# EAGLE schematic Stepperdriver (EAGLE 6.1)
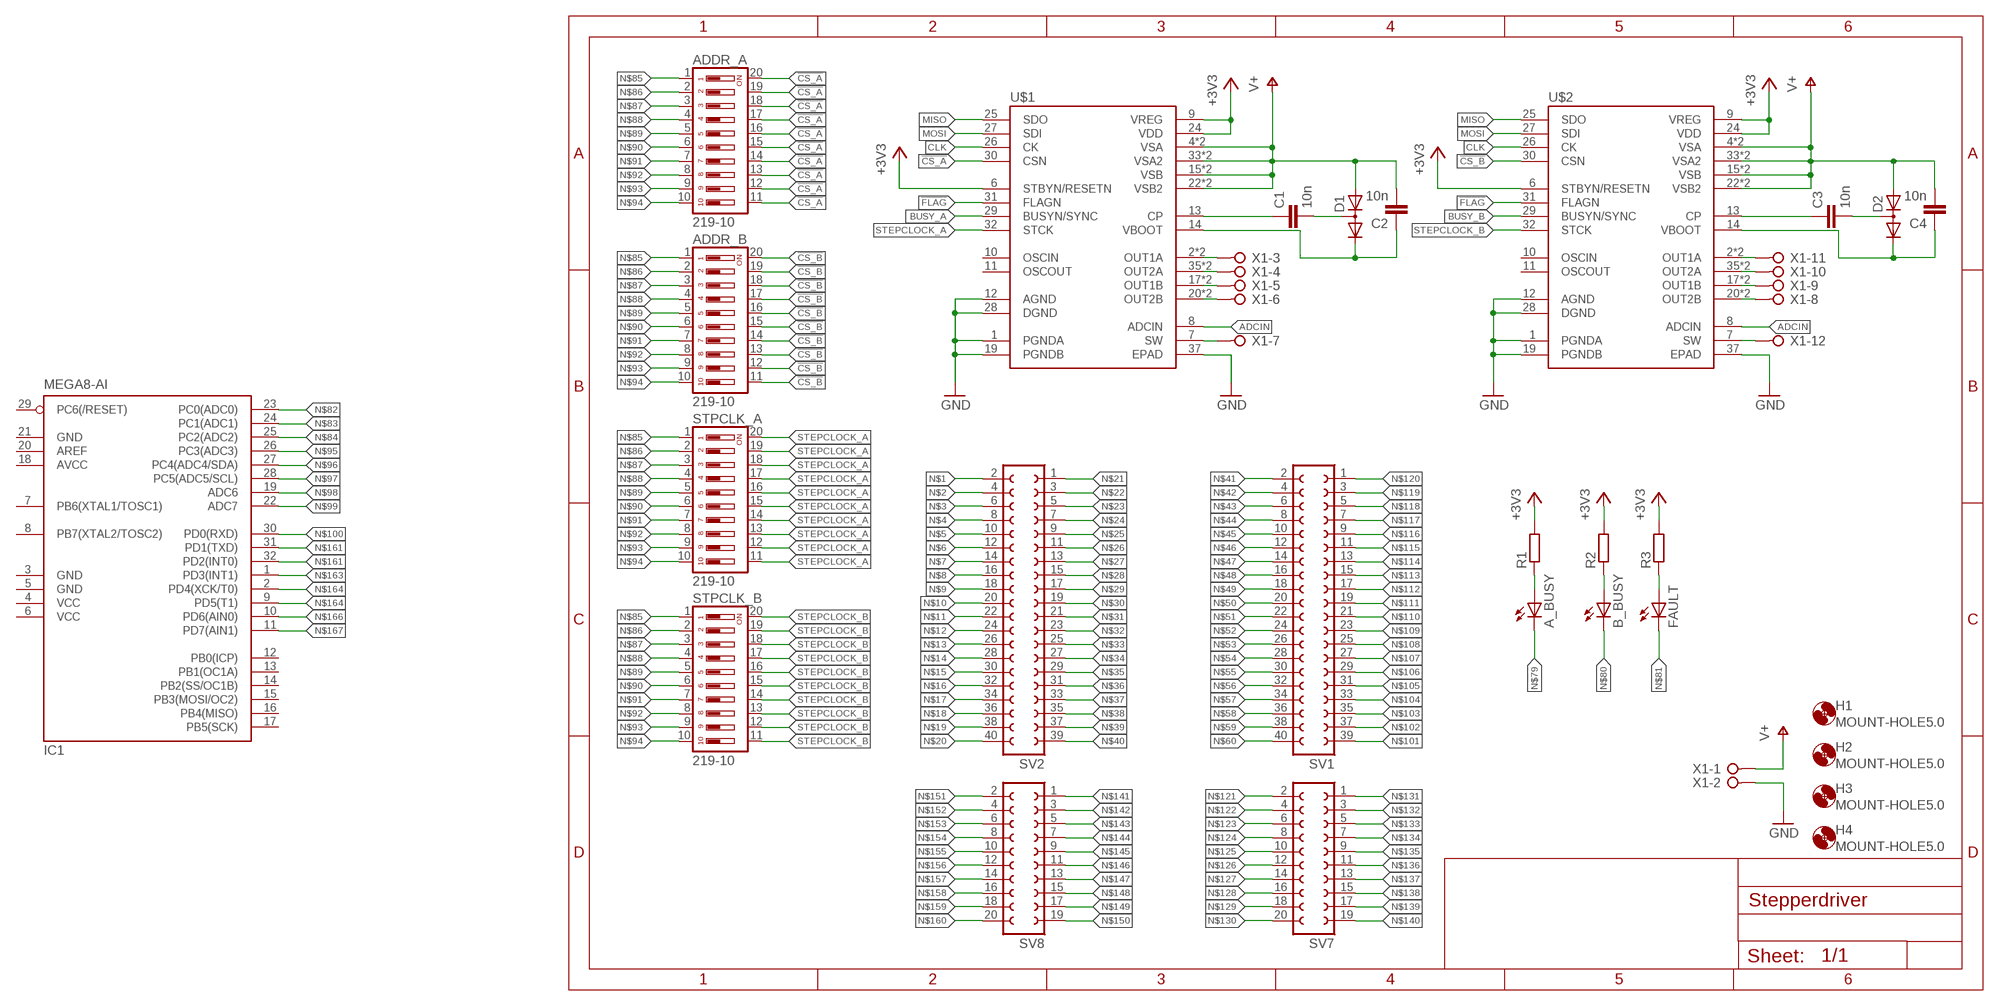
[diagram p0: schematic, sheet 1]

## Parts
A_BUSY  LEDCHIP-LED0805  [CHIP-LED0805]
ADDR_A  219-10  [CTS-219-10]
ADDR_B  219-10  [CTS-219-10]
B_BUSY  LEDCHIP-LED0805  [CHIP-LED0805]
C1  10n  C-EUC0805  [C0805]
C2  10n  C-EUC0805  [C0805]
C3  10n  C-EUC0805  [C0805]
C4  10n  C-EUC0805  [C0805]
D1  DIODE_2CACA-SOT23  [SOT23]
D2  DIODE_2CACA-SOT23  [SOT23]
FAULT  LEDCHIP-LED0805  [CHIP-LED0805]
H1  MOUNT-HOLE5.0  [5,0]
H2  MOUNT-HOLE5.0  [5,0]
H3  MOUNT-HOLE5.0  [5,0]
H4  MOUNT-HOLE5.0  [5,0]
IC1  MEGA8-AI  [TQFP32-08]
R1  R-EU_R0805  [R0805]
R2  R-EU_R0805  [R0805]
R3  R-EU_R0805  [R0805]
STPCLK_A  219-10  [CTS-219-10]
STPCLK_B  219-10  [CTS-219-10]
SV1  FE20-2  [FE20-2]
SV2  FE20-2  [FE20-2]
SV7  FE10-2  [FE10-2]
SV8  FE10-2  [FE10-2]
U$1  L6470HPOWERSO36  [SOP65P1400X360-37N]
U$2  L6470HPOWERSO36  [SOP65P1400X360-37N]
X1  W237-12P  [W237-12P]

## Nets
!CS_A: ADDR_A.11 ADDR_A.12 ADDR_A.13 ADDR_A.14 ADDR_A.15 ADDR_A.16 ADDR_A.17 ADDR_A.18 ADDR_A.19 ADDR_A.20 U$1.30(CSN)
!CS_B: ADDR_B.11 ADDR_B.12 ADDR_B.13 ADDR_B.14 ADDR_B.15 ADDR_B.16 ADDR_B.17 ADDR_B.18 ADDR_B.19 ADDR_B.20 U$2.30(CSN)
!FLAG: U$1.31(FLAGN) U$2.31(FLAGN)
+3V3: R1.2 R2.2 R3.2 U$1.6(STBYN/RESETN) U$1.9(VREG) U$1.24(VDD) U$2.6(STBYN/RESETN) U$2.9(VREG) U$2.24(VDD)
ADCIN: U$1.8(ADCIN) U$2.8(ADCIN)
BUSY_A: U$1.29(BUSYN/SYNC)
BUSY_B: U$2.29(BUSYN/SYNC)
CLK: U$1.26(CK) U$2.26(CK)
GND: U$1.1(PGNDA) U$1.12(AGND) U$1.19(PGNDB) U$1.28(DGND) U$1.37(EPAD) U$2.1(PGNDA) U$2.12(AGND) U$2.19(PGNDB) U$2.28(DGND) U$2.37(EPAD) X1.2
MISO: U$1.25(SDO) U$2.25(SDO)
MOSI: U$1.27(SDI) U$2.27(SDI)
N$1: SV2.2
N$2: SV2.4
N$3: SV2.6
N$4: SV2.8
N$5: SV2.10
N$6: SV2.12
N$7: SV2.14
N$8: SV2.16
N$9: SV2.18
N$10: SV2.20
N$11: SV2.22
N$12: SV2.24
N$13: SV2.26
N$14: SV2.28
N$15: SV2.30
N$16: SV2.32
N$17: SV2.34
N$18: SV2.36
N$19: SV2.38
N$20: SV2.40
N$21: SV2.1
N$22: SV2.3
N$23: SV2.5
N$24: SV2.7
N$25: SV2.9
N$26: SV2.11
N$27: SV2.13
N$28: SV2.15
N$29: SV2.17
N$30: SV2.19
N$31: SV2.21
N$32: SV2.23
N$33: SV2.25
N$34: SV2.27
N$35: SV2.29
N$36: SV2.31
N$37: SV2.33
N$38: SV2.35
N$39: SV2.37
N$40: SV2.39
N$41: SV1.2
N$42: SV1.4
N$43: SV1.6
N$44: SV1.8
N$45: SV1.10
N$46: SV1.12
N$47: SV1.14
N$48: SV1.16
N$49: SV1.18
N$50: SV1.20
N$51: SV1.22
N$52: SV1.24
N$53: SV1.26
N$54: SV1.28
N$55: SV1.30
N$56: SV1.32
N$57: SV1.34
N$58: SV1.36
N$59: SV1.38
N$60: SV1.40
N$61: C3.1 U$2.13(CP)
N$62: C3.2 D2.3(AC)
N$63: C4.1 D2.2(C) U$2.14(VBOOT)
N$64: U$2.20(OUT2B) U$2.21(OUT2B) X1.8
N$65: U$2.17(OUT1B) U$2.18(OUT1B) X1.9
N$66: U$2.35(OUT2A) U$2.36(OUT2A) X1.10
N$67: A_BUSY.A R1.1
N$68: U$2.2(OUT1A) U$2.3(OUT1A) X1.11
N$69: U$1.2(OUT1A) U$1.3(OUT1A) X1.3
N$70: U$1.35(OUT2A) U$1.36(OUT2A) X1.4
N$71: C1.1 U$1.13(CP)
N$72: U$1.17(OUT1B) U$1.18(OUT1B) X1.5
N$73: U$1.20(OUT2B) U$1.21(OUT2B) X1.6
N$74: C1.2 D1.3(AC)
N$75: C2.1 D1.2(C) U$1.14(VBOOT)
N$76: U$2.7(SW) X1.12
N$77: B_BUSY.A R2.1
N$78: FAULT.A R3.1
N$79: A_BUSY.C
N$80: B_BUSY.C
N$81: FAULT.C
N$82: IC1.23(PC0(ADC0))
N$83: IC1.24(PC1(ADC1))
N$84: IC1.25(PC2(ADC2))
N$85: ADDR_A.1 ADDR_B.1 STPCLK_A.1 STPCLK_B.1
N$86: ADDR_A.2 ADDR_B.2 STPCLK_A.2 STPCLK_B.2
N$87: ADDR_A.3 ADDR_B.3 STPCLK_A.3 STPCLK_B.3
N$88: ADDR_A.4 ADDR_B.4 STPCLK_A.4 STPCLK_B.4
N$89: ADDR_A.5 ADDR_B.5 STPCLK_A.5 STPCLK_B.5
N$90: ADDR_A.6 ADDR_B.6 STPCLK_A.6 STPCLK_B.6
N$91: ADDR_A.7 ADDR_B.7 STPCLK_A.7 STPCLK_B.7
N$92: ADDR_A.8 ADDR_B.8 STPCLK_A.8 STPCLK_B.8
N$93: ADDR_A.9 ADDR_B.9 STPCLK_A.9 STPCLK_B.9
N$94: ADDR_A.10 ADDR_B.10 STPCLK_A.10 STPCLK_B.10
N$95: IC1.26(PC3(ADC3))
N$96: IC1.27(PC4(ADC4/SDA))
N$97: IC1.28(PC5(ADC5/SCL))
N$98: IC1.19(ADC6)
N$99: IC1.22(ADC7)
N$100: IC1.30(PD0(RXD))
N$101: SV1.39
N$102: SV1.37
N$103: SV1.35
N$104: SV1.33
N$105: SV1.31
N$106: SV1.29
N$107: SV1.27
N$108: SV1.25
N$109: SV1.23
N$110: SV1.21
N$111: SV1.19
N$112: SV1.17
N$113: SV1.15
N$114: SV1.13
N$115: SV1.11
N$116: SV1.9
N$117: SV1.7
N$118: SV1.5
N$119: SV1.3
N$120: SV1.1
N$121: SV7.2
N$122: SV7.4
N$123: SV7.6
N$124: SV7.8
N$125: SV7.10
N$126: SV7.12
N$127: SV7.14
N$128: SV7.16
N$129: SV7.18
N$130: SV7.20
N$131: SV7.1
N$132: SV7.3
N$133: SV7.5
N$134: SV7.7
N$135: SV7.9
N$136: SV7.11
N$137: SV7.13
N$138: SV7.15
N$139: SV7.17
N$140: SV7.19
N$141: SV8.1
N$142: SV8.3
N$143: SV8.5
N$144: SV8.7
N$145: SV8.9
N$146: SV8.11
N$147: SV8.13
N$148: SV8.15
N$149: SV8.17
N$150: SV8.19
N$151: SV8.2
N$152: SV8.4
N$153: SV8.6
N$154: SV8.8
N$155: SV8.10
N$156: SV8.12
N$157: SV8.14
N$158: SV8.16
N$159: SV8.18
N$160: SV8.20
N$161: IC1.31(PD1(TXD))
N$162: IC1.32(PD2(INT0))
N$163: IC1.1(PD3(INT1))
N$164: IC1.2(PD4(XCK/T0))
N$165: IC1.9(PD5(T1))
N$166: IC1.10(PD6(AIN0))
N$167: IC1.11(PD7(AIN1))
STEPCLOCK_A: STPCLK_A.11 STPCLK_A.12 STPCLK_A.13 STPCLK_A.14 STPCLK_A.15 STPCLK_A.16 STPCLK_A.17 STPCLK_A.18 STPCLK_A.19 STPCLK_A.20 U$1.32(STCK)
STEPCLOCK_B: STPCLK_B.11 STPCLK_B.12 STPCLK_B.13 STPCLK_B.14 STPCLK_B.15 STPCLK_B.16 STPCLK_B.17 STPCLK_B.18 STPCLK_B.19 STPCLK_B.20 U$2.32(STCK)
SW_A: U$1.7(SW) X1.7
V+: C2.2 C4.2 D1.1(A) D2.1(A) U$1.4(VSA) U$1.5(VSA) U$1.15(VSB) U$1.16(VSB) U$1.22(VSB2) U$1.23(VSB2) U$1.33(VSA2) U$1.34(VSA2) U$2.4(VSA) U$2.5(VSA) U$2.15(VSB) U$2.16(VSB) U$2.22(VSB2) U$2.23(VSB2) U$2.33(VSA2) U$2.34(VSA2) X1.1
Unconnected: IC1.7(PB6(XTAL1/TOSC1)) IC1.8(PB7(XTAL2/TOSC2)) IC1.12(PB0(ICP)) IC1.13(PB1(OC1A)) IC1.14(PB2(SS/OC1B)) IC1.15(PB3(MOSI/OC2)) IC1.16(PB4(MISO)) IC1.17(PB5(SCK)) IC1.20(AREF) IC1.29(PC6(/RESET)) U$1.10(OSCIN) U$1.11(OSCOUT) U$2.10(OSCIN) U$2.11(OSCOUT)

## Power pins joined to a net without a drawn wire
AVCC: IC1.18(AVCC)
GND: IC1.3(GND) IC1.5(GND) IC1.21(GND)
VCC: IC1.4(VCC) IC1.6(VCC)

## Library data of the parts
A_BUSY B_BUSY FAULT = led:LED: LED OSRAM: - CHIPLED LG R971, LG N971, LY N971, LG Q971, LY Q971, LO R971, LY R971 LH N974, LH R974 LS Q976, LO Q976, LY Q976 LO Q996 - Hyper CHIPLED LW Q18S LB Q993, LB Q99A, LB R99A - SideLED LS A670, LO A670, LY A670, LG A670, LP A670 LB A673, LV A673, LT A673, LW A673 LH A674 LY A675 LS A676, LA A676, LO A676, LY A676, LW A676 LS A679, LY A679, LG A679 - Hyper Micro SIDELED® LS Y876, LA Y876, LO Y876, LY Y876 LT Y87S - SmartLED LW L88C, LW L88S LB L89C, LB L89S, LG L890 LS L89K, LO L89K, LY L89K LS L896, LA L896, LO L896, LY L896 - TOPLED LS T670, LO T670, LY T670, LG T670, LP T670 LSG T670, LSP T670, LSY T670, LOP T670, LYG T670 LG T671, LOG T671, LSG T671 LB T673, LV T673, LT T673, LW T673 LH T674 LS T676, LA T676, LO T676, LY T676, LB T676, LH T676, LSB T676, LW T676 LB T67C, LV T67C, LT T67C, LS T67K, LO T67K, LY T67K, LW E67C LS E67B, LA E67B, LO E67B, LY E67B, LB E67C, LV E67C, LT E67C LW T67C LS T679, LY T679, LG T679 LS T770, LO T770, LY T770, LG T770, LP T770 LB T773, LV T773, LT T773, LW T773 LH T774 LS E675, LA E675, LY E675, LS T675 LS T776, LA T776, LO T776, LY T776, LB T776 LHGB T686 LT T68C, LB T68C - Hyper Mini TOPLED® LB M676 - Mini TOPLED Santana® LG M470 LS M47K, LO M47K, LY M47K Source: http://www.osram.convergy.de LUXEON: - LUMILED® LXK2-PW12-R00, LXK2-PW12-S00, LXK2-PW14-U00, LXK2-PW14-V00 LXK2-PM12-R00, LXK2-PM12-S00, LXK2-PM14-U00 LXK2-PE12-Q00, LXK2-PE12-R00, LXK2-PE12-S00, LXK2-PE14-T00, LXK2-PE14-U00 LXK2-PB12-K00, LXK2-PB12-L00, LXK2-PB12-M00, LXK2-PB14-N00, LXK2-PB14-P00, LXK2-PB14-Q00 LXK2-PR12-L00, LXK2-PR12-M00, LXK2-PR14-Q00, LXK2-PR14-R00 LXK2-PD12-Q00, LXK2-PD12-R00, LXK2-PD12-S00 LXK2-PH12-R00, LXK2-PH12-S00 LXK2-PL12-P00, LXK2-PL12-Q00, LXK2-PL12-R00 Source: www.luxeon.com KINGBRIGHT: KA-3528ASYC Source: www.kingbright.com
ADDR_A ADDR_B STPCLK_A STPCLK_B = switch-dil:219-10*: Surface Mount DIP Switch Series 219 SMT CTS Electronic Components Sourc: www.ctscorp.com; MF: SLI (CML/IDI); MPN: 219-10PK; OC_FARNELL: unknown; OC_NEWARK: 19M0224
C1-C4 = rcl:C-EU: CAPACITOR, European symbol
D1 D2 = diode:DIODE_2CACA-: 2 Diodes - Cathode-Anode|Cathode-Anode
H1-H4 = holes:MOUNT-HOLE: MOUNTING HOLE with drill center marker
IC1 = atmel:MEGA8: MICROCONTROLLER 8 Kbytes FLASH, 1 kbytes SRAM, 512 bytes EEPROM, USART, 6-channel 10 bit ADC, 2-channel 8 bit ADC Pin compatible with Atmega48, ATMega88, ATMega168 Source: avr.lbr; MPN: ATMEGA8-16AU; OC_FARNELL: 9171371; OC_NEWARK: 73M8863
R1-R3 = rcl:R-EU_: RESISTOR, European symbol
SV1 SV2 = con-lsta:FE20-2: FEMALE HEADER; OC_FARNELL: unknown; OC_NEWARK: unknown
SV7 SV8 = con-lsta:FE10-2: FEMALE HEADER; OC_FARNELL: unknown; OC_NEWARK: unknown
U$1 U$2 = Hardware:L6470H
X1 = con-wago-508:W237-12P: WAGO SREW CLAMP; OC_FARNELL: unknown; OC_NEWARK: unknown